# Altium schematic sheet 6_SurvBot_RCU_CurrentFeedback.SchDoc
size A4; SheetNumber: 7; SheetTotal: 8
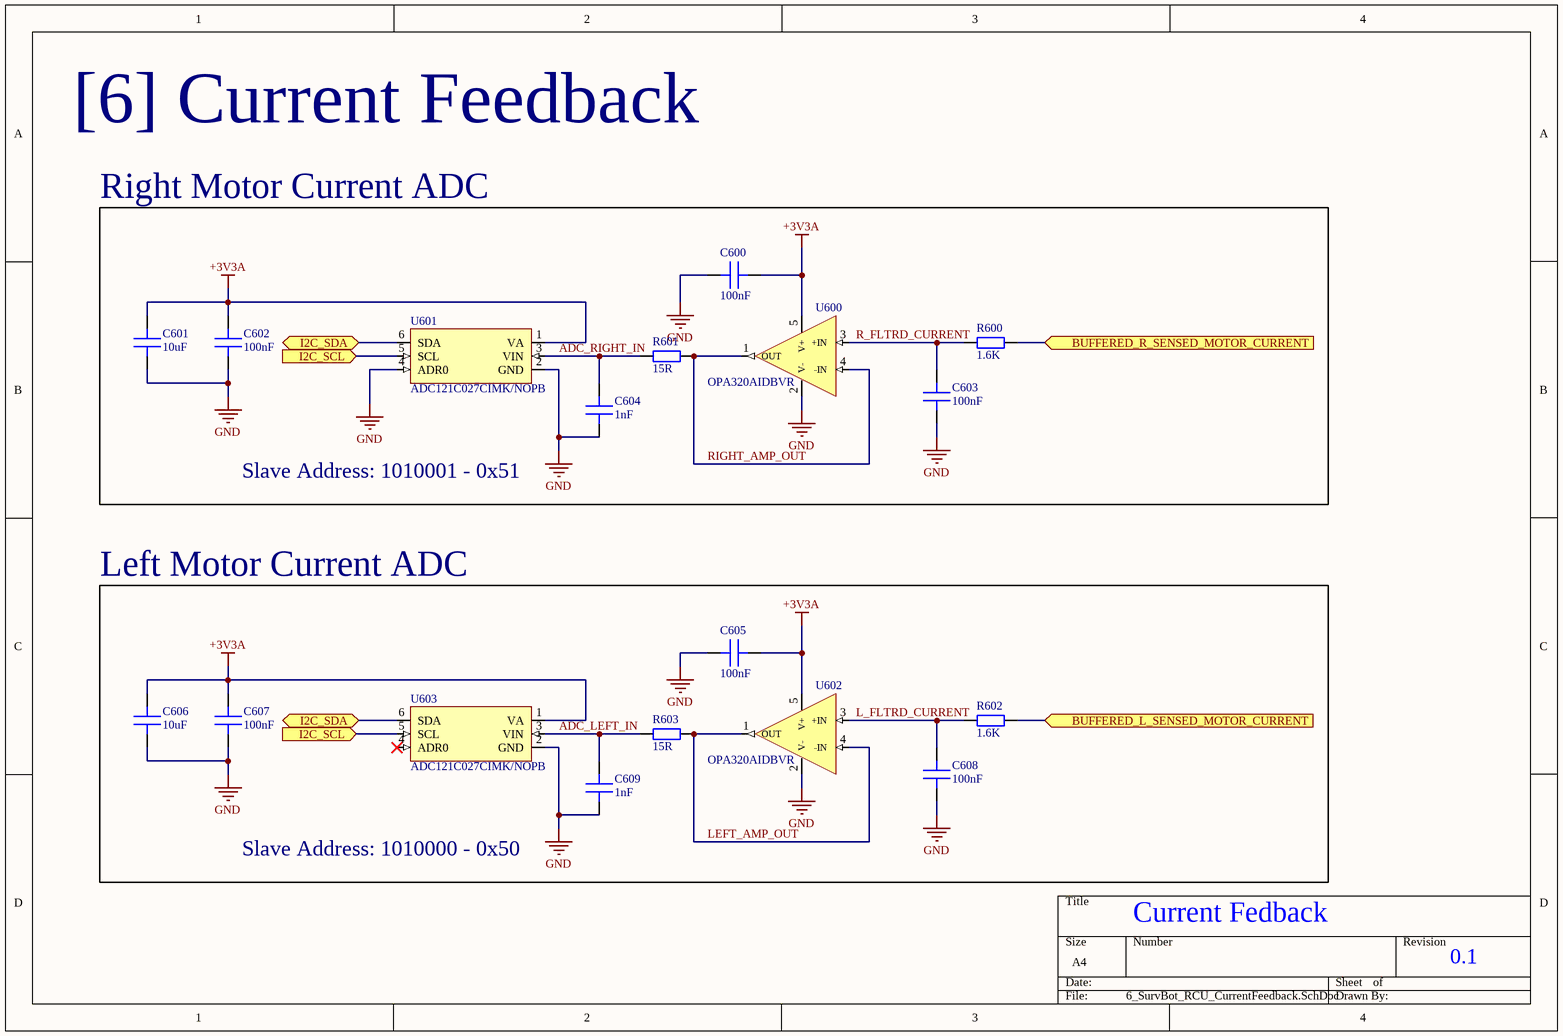
[diagram p0: 6_SurvBot_RCU_CurrentFeedback.SchDoc]

## Parts
C600  100nF  [CAP_0402]
C601  10uF  [CAP_0402]
C602  100nF  [CAP_0402]
C603  100nF  [CAP_0603]
C604  1nF  [CAP_0402]
C605  100nF  [CAP_0402]
C606  10uF  [CAP_0402]
C607  100nF  [CAP_0402]
C608  100nF  [CAP_0603]
C609  1nF  [CAP_0402]
R600  1.6K  [RES_0603]
R601  15R  [RES_0603]
R602  1.6K  [RES_0603]
R603  15R  [RES_0603]
U600  OPA320AIDBVR  [SOT-23-5]
U601  ADC121C027CIMK/NOPB  [SOT-23-6 Thin, TSOT-23-6]
U602  OPA320AIDBVR  [SOT-23-5]
U603  ADC121C027CIMK/NOPB  [SOT-23-6 Thin, TSOT-23-6]

## Blocks framed on the sheet
Right Motor Current ADC: C600-C604 R600 R601 U600 U601
Left Motor Current ADC: C605-C609 R602 R603 U602 U603

## Ports
BUFFERED_L_SENSED_MOTOR_CURRENT (in, see 0_SurvBot_RCU_Overview[4D], 3_SurvBot_RCU_MotorControl[1C]), BUFFERED_R_SENSED_MOTOR_CURRENT (in, see 0_SurvBot_RCU_Overview[4D], 3_SurvBot_RCU_MotorControl[1B]), I2C_SCL (in, see 0_SurvBot_RCU_Overview[3C], 2_SurvBot_RCU_MCU[2B], 5_SurvBot_RCU_Sensors[1B], 5_SurvBot_RCU_Sensors[2D], 5_SurvBot_RCU_Sensors[3B]), I2C_SDA (bidir, see 0_SurvBot_RCU_Overview[3D], 2_SurvBot_RCU_MCU[2B], 5_SurvBot_RCU_Sensors[1B], 5_SurvBot_RCU_Sensors[2C], 5_SurvBot_RCU_Sensors[3B])

## Nets
+3V3A: C600.2 C601.2 C602.2 C605.2 C606.2 C607.2 U600.5(V+) U601.1(VA) U602.5(V+) U603.1(VA)
GND: C600.1 C601.1 C602.1 C603.1 C604.1 C605.1 C606.1 C607.1 C608.1 C609.1 U600.2(V-) U601.2(GND) U601.4(ADR0) U602.2(V-) U603.2(GND)
ADC_LEFT_IN: C609.2 R603.1 U603.3(VIN)
ADC_RIGHT_IN: C604.2 R601.1 U601.3(VIN)
BUFFERED_L_SENSED_MOTOR_CURRENT: R602.2 ; port BUFFERED_L_SENSED_MOTOR_CURRENT
BUFFERED_R_SENSED_MOTOR_CURRENT: R600.2 ; port BUFFERED_R_SENSED_MOTOR_CURRENT
I2C_SCL: U601.5(SCL) U603.5(SCL) ; port I2C_SCL
I2C_SDA: U601.6(SDA) U603.6(SDA) ; port I2C_SDA
L_FLTRD_CURRENT: C608.2 R602.1 U602.3(+IN)
LEFT_AMP_OUT: R603.2 U602.1(OUT) U602.4(-IN)
R_FLTRD_CURRENT: C603.2 R600.1 U600.3(+IN)
RIGHT_AMP_OUT: R601.2 U600.1(OUT) U600.4(-IN)

Not connected (* = marked no-connect by the designer): U603 4(ADR0)*

## Notes on the sheet
- [6] Current Feedback
- Slave Address: 1010001 - 0x51
- Slave Address: 1010000 - 0x50
- Current Fedback
- 0.1

## Library data of the parts
C600 C602 C605 C607 = CAP_100nF-10V-10%-0402: 0.1 µF ±10% 10V Ceramic Capacitor X7R 0402 (1005 Metric); Manufacturer: Samsung Electro-Mechanics; Manufacturer Part #: CL05B104KP5NNNC; Case/Package: 0402; Supplier: JLCPCB; Supplier Part #: C133086
C601 C606 = CAP_10uF-10V-20%-0402: 10 µF ±20% 10V Ceramic Capacitor X5R 0402 (1005 Metric); Manufacturer: Murata Electronics; Manufacturer Part #: GRM155R61A106ME11D; Case/Package: 0402; Supplier: JLCPCB; Supplier Part #: C408132
C603 C608 = CAP_100nF-50V-10%-0603: 0.1 µF ±10% 50V Ceramic Capacitor X7R 0603 (1608 Metric); Manufacturer: KEMET; Manufacturer Part #: C0603C104K5RACAUTO; Case/Package: 0603; Supplier: JLCPCB; Supplier Part #: C129621
C604 C609 = CAP_1nF-50V-5%-0402: 1000 pF ±5% 50V Ceramic Capacitor C0G, NP0 0402 (1005 Metric); Manufacturer: Murata Electronics; Manufacturer Part #: GRM1555C1H102JA01D; Case/Package: 0402; Supplier: JLCPCB; Supplier Part #: C76947
R600 R602 = RES_1.6K-100mW-1%-0603: 1.6 kOhms ±1% 0.1W, 1/10W Chip Resistor 0603 (1608 Metric) Moisture Resistant Thick Film; Manufacturer: BOURNS; Manufacturer Part #: CR0603-FX-1601ELF; Case/Package: 0603; Supplier: JLCPCB; Supplier Part #: C203329
R601 R603 = RES_15R-100mW-1%-0603: 15 Ohms ±1% 0.1W, 1/10W Chip Resistor 0603 (1608 Metric) Automotive AEC-Q200 Thick Film; Manufacturer: PANASONIC; Manufacturer Part #: ERJ3EKF15R0V; Case/Package: 0603; Supplier: JLCPCB; Supplier Part #: C403005
U600 U602 = OPAMP-OPA320_R2R_SOT23-5: General Purpose Amplifier 1 Circuit Rail-to-Rail SOT-23-5; Manufacturer: Texas Instruments; Manufacturer Part #: OPA320AIDBVR; Case/Package: SOT-23-5; Supplier: JLCPCB; Supplier Part #: C92494
U601 U603 = IC_ADC121C027CIMK/NOPB: 12 Bit Analog to Digital Converter 1 Input 1 SAR TSOT-23-6; Manufacturer: Texas Instruments; Manufacturer Part #: ADC121C027CIMK/NOPB; Case/Package: TSOT-23-6L; Supplier: JLCPCB; Supplier Part #: C201638